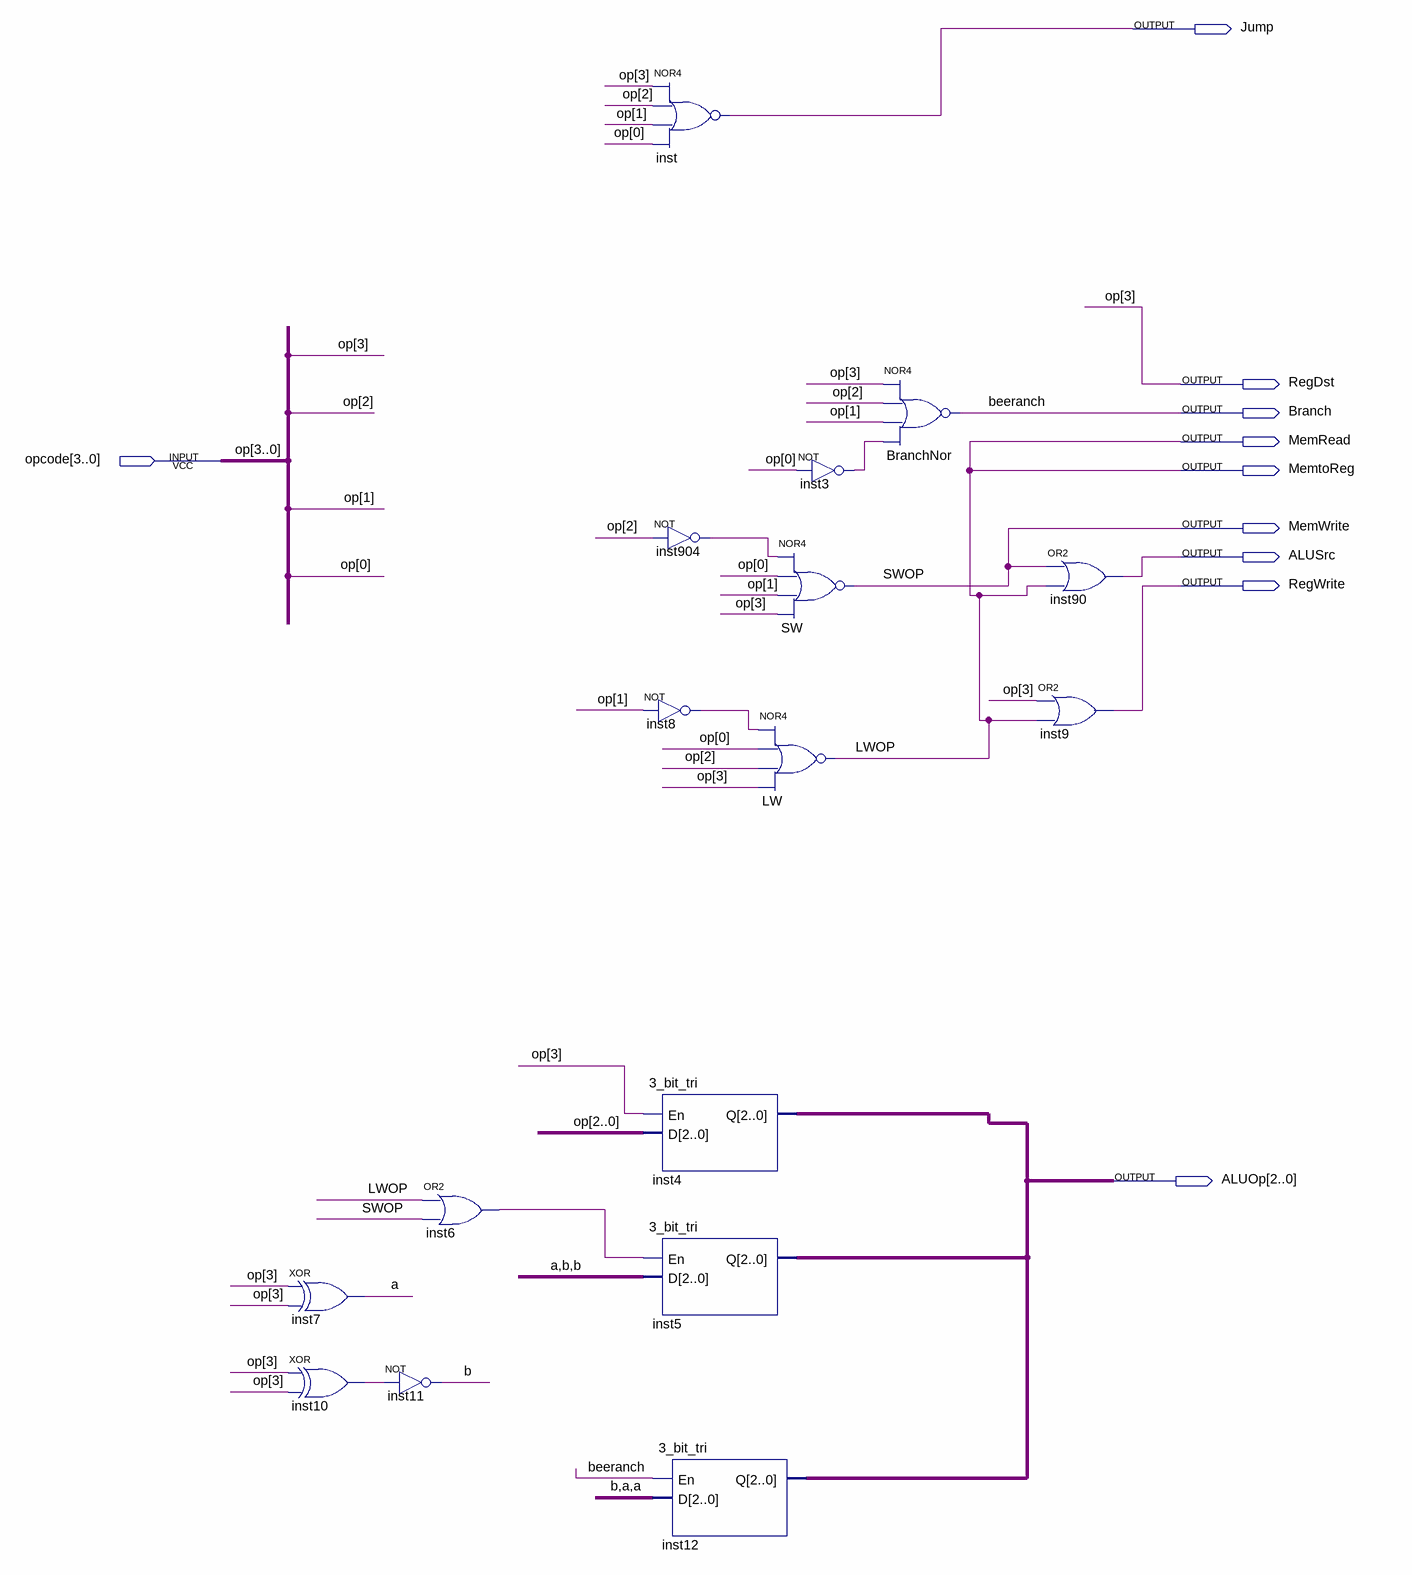
[diagram p0: schematic sheet]
// Quartus schematic control.bdf as structural Verilog: 16 symbols, 10 pins
module control (
  input  [3:0] opcode,
  output Jump,
  output RegDst,
  output Branch,
  output MemRead,
  output MemtoReg,
  output MemWrite,
  output ALUSrc,
  output RegWrite,
  output [2:0] ALUOp
);

  wire a, b, inst3_out, inst6_out, inst8_out, inst10_out, inst904_out;

  xor inst7 (a, opcode[3], opcode[3]);
  xor inst10 (inst10_out, opcode[3], opcode[3]);
  or inst6 (inst6_out, MemRead, MemWrite);
  not inst11 (b, inst10_out);
  nor inst (Jump, opcode[3], opcode[2], opcode[1], opcode[0]);
  not inst904 (inst904_out, opcode[2]);
  not inst8 (inst8_out, opcode[1]);
  \3_bit_tri  inst4 (.En(opcode[3]), .D(opcode[2:0]), .Q(ALUOp));
  \3_bit_tri  inst5 (.En(inst6_out), .D({a, {2{b}}}), .Q(ALUOp));
  \3_bit_tri  inst12 (.En(Branch), .D({b, {2{a}}}), .Q(ALUOp));
  not inst3 (inst3_out, opcode[0]);
  nor SW (MemWrite, inst904_out, opcode[0], opcode[1], opcode[3]);
  nor LW (MemRead, inst8_out, opcode[0], opcode[2], opcode[3]);
  nor BranchNor (Branch, opcode[3], opcode[2], opcode[1], inst3_out);
  or inst90 (ALUSrc, MemWrite, MemRead);
  or inst9 (RegWrite, opcode[3], MemRead);

  assign MemtoReg = MemRead;
  assign RegDst = opcode[3];

  // Other names for the same wires on the sheet: beeranch = Branch; LWOP = MemRead; SWOP = MemWrite; op[3:0] = opcode
endmodule
